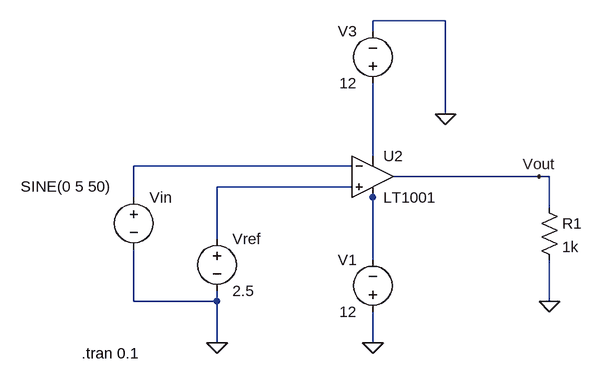
[diagram p0: schematic Comparator_Op_amp.asc]
Comparator_Op_amp.asc, the LTspice schematic file:
Version 4
SHEET 1 880 680
WIRE 368 -96 256 -96
WIRE 256 -80 256 -96
WIRE 368 48 368 -96
WIRE 256 112 256 0
WIRE 224 128 -112 128
WIRE 512 144 288 144
WIRE 528 144 512 144
WIRE 224 160 16 160
WIRE -112 176 -112 128
WIRE 256 176 256 160
WIRE 528 192 528 144
WIRE 16 240 16 160
WIRE 256 272 256 176
WIRE -112 336 -112 256
WIRE 16 336 16 320
WIRE 16 336 -112 336
WIRE 528 336 528 272
WIRE 16 400 16 336
WIRE 256 400 256 352
FLAG 528 336 0
FLAG 256 400 0
FLAG 16 400 0
FLAG 368 48 0
FLAG 512 144 Vout
SYMBOL voltage -112 160 R0
WINDOW 3 -174 -1 Left 2
WINDOW 123 0 0 Left 0
WINDOW 39 0 0 Left 0
SYMATTR InstName Vin
SYMATTR Value SINE(0 5 50)
SYMBOL voltage 16 224 R0
SYMATTR InstName Vref
SYMATTR Value 2.5
SYMBOL res 512 176 R0
SYMATTR InstName R1
SYMATTR Value 1k
SYMBOL voltage 256 16 R180
WINDOW 0 24 96 Left 2
WINDOW 3 24 16 Left 2
SYMATTR InstName V3
SYMATTR Value 12
SYMBOL voltage 256 368 R180
WINDOW 0 24 96 Left 2
WINDOW 3 24 16 Left 2
SYMATTR InstName V1
SYMATTR Value 12
SYMBOL OpAmps\\LT1001 256 80 R0
SYMATTR InstName U2
TEXT -192 416 Left 2 !.tran 0.1

The netlist it stands for:
* Comparator_Op_amp.asc
Vin N002 0 SINE(0 5 50)
Vref N003 0 2.5
R1 Vout 0 1k
V3 N001 0 12
V1 0 N004 12
XU2 N003 N002 N001 N004 Vout LT1001  ; pins In+ In- V+ V- OUT
.tran 0.1
.lib LTC.lib
.backanno
.end